# Altium schematic sheet TITLE.SchDoc
size A3; DocumentNumber: 1; Revision: B; SheetNumber: 1; SheetTotal: 7; SheetTitle: Block Diagrams; Designer: DM; Reviewer: -
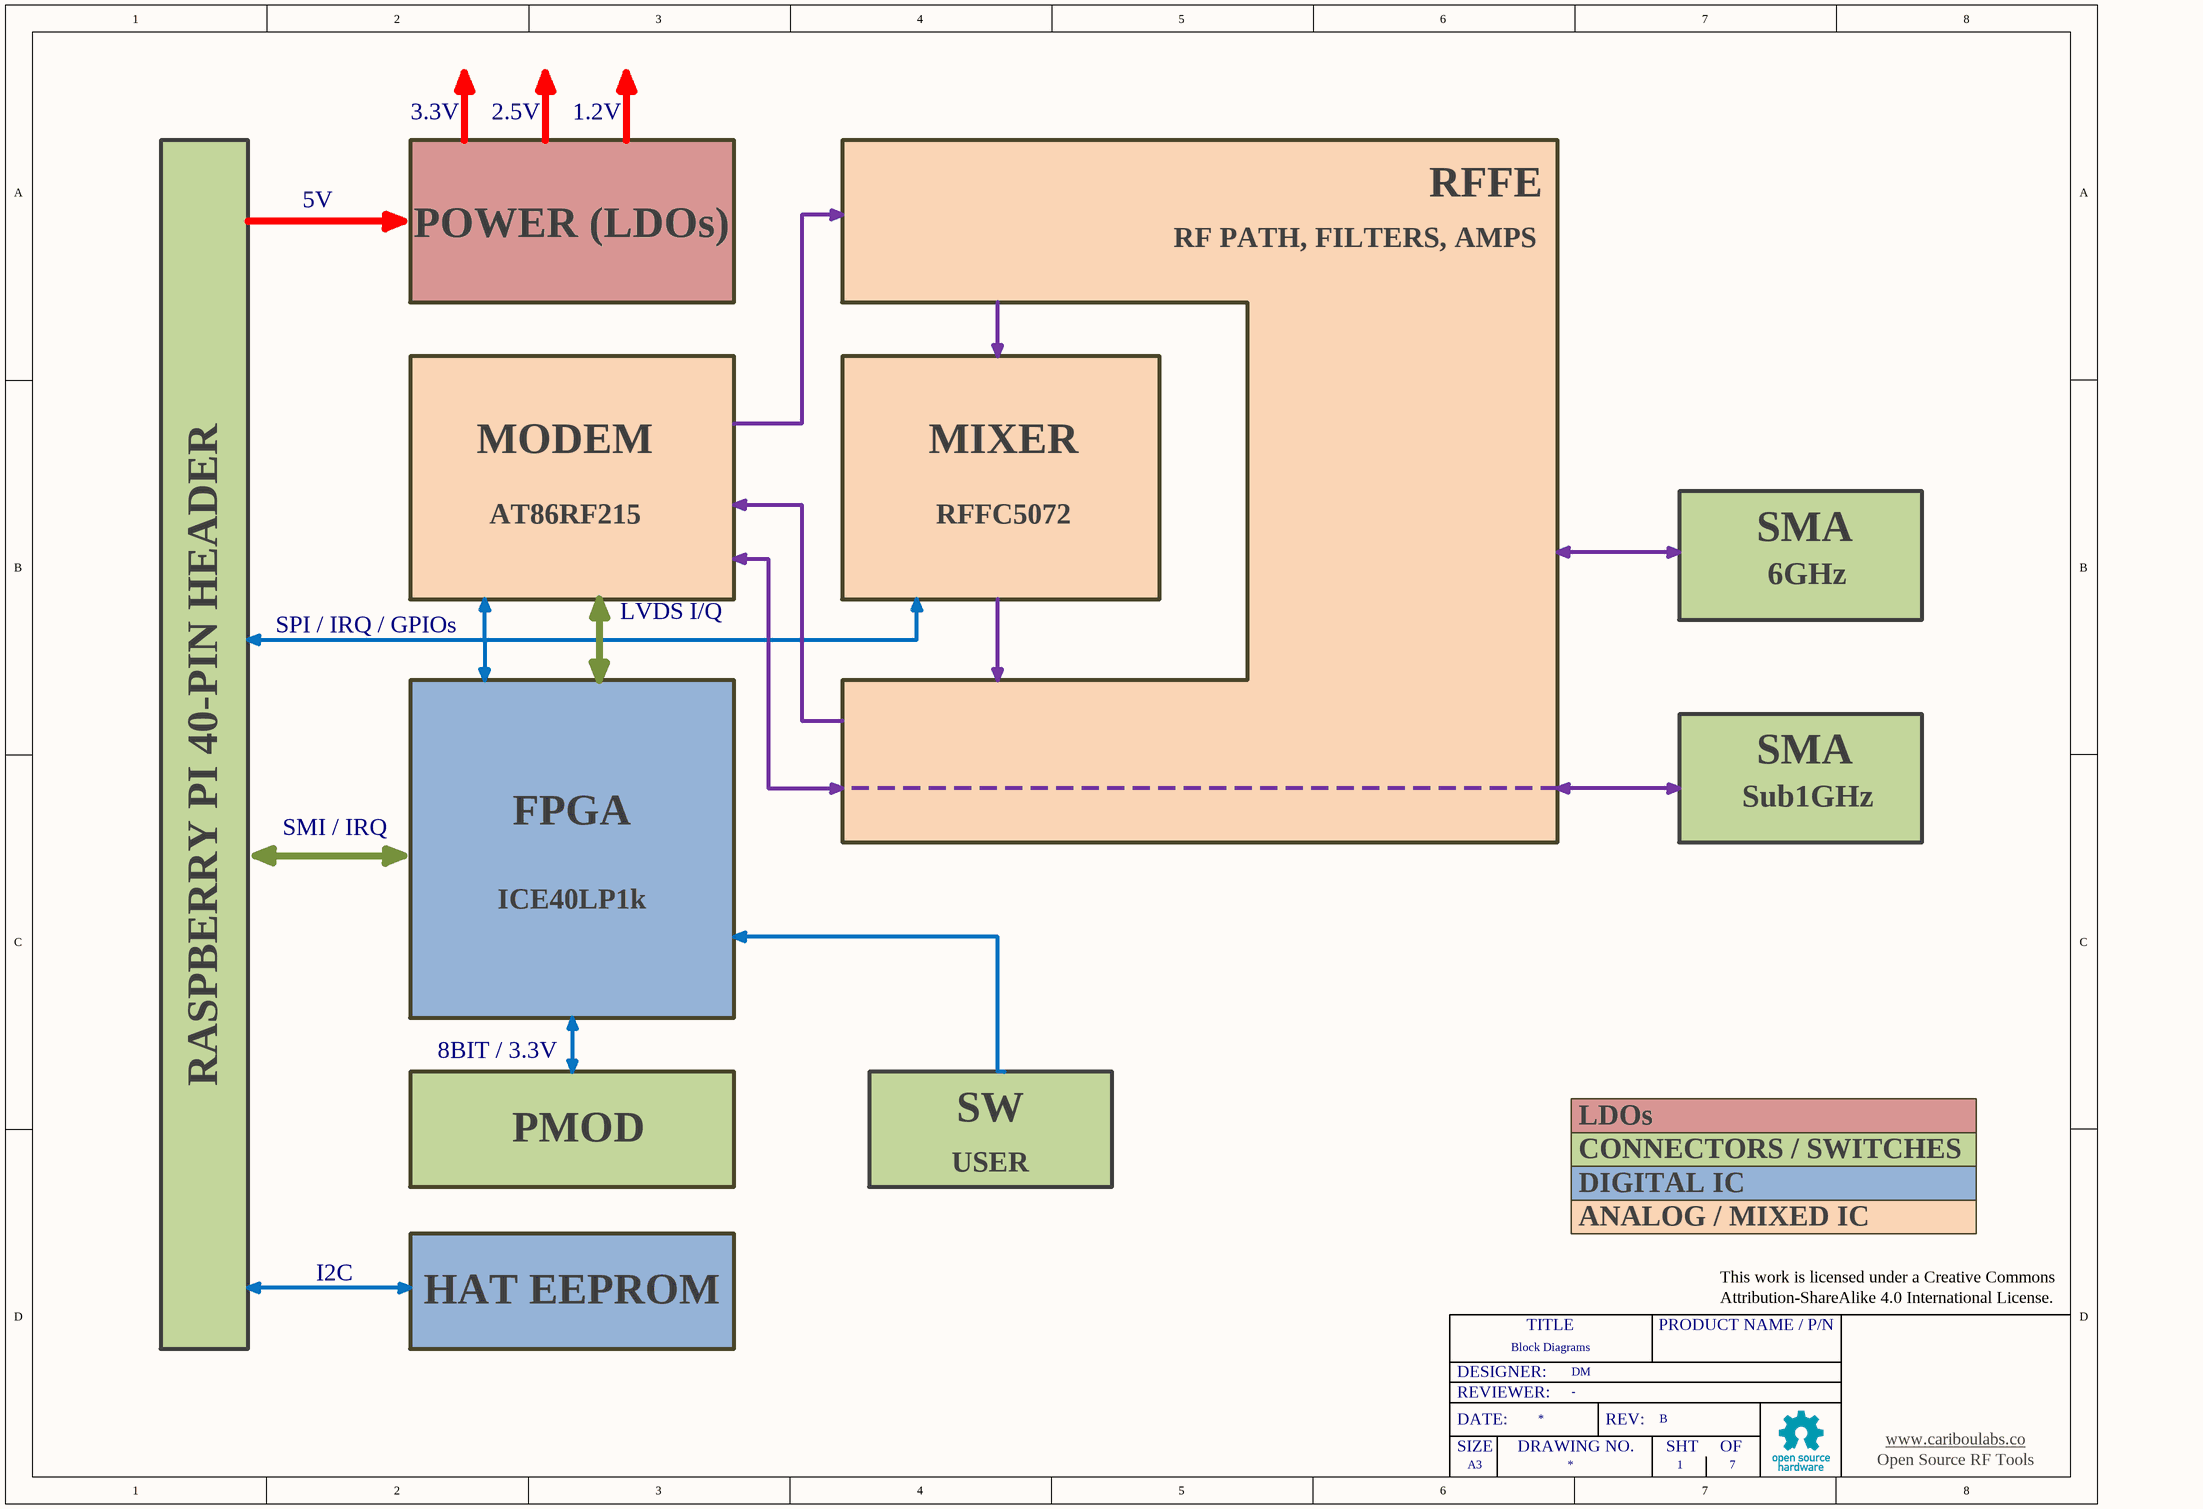
[diagram p0: TITLE.SchDoc]

## Notes on the sheet
- 3.3V
- 2.5V
- 1.2V
- 5V
- POWER (LDOs)
- RFFE
- RF PATH, FILTERS, AMPS
- MODEM
- MIXER
- AT86RF215
- RFFC5072
- 6GHz
- SMA
- SPI / IRQ / GPIOs
- LVDS I/Q
- RASPBERRY PI 40-PIN HEADER
- SMI / IRQ
- FPGA
- Sub1GHz
- ICE40LP1k
- 8BIT / 3.3V
- SW
- LDOs
- PMOD
- USER
- CONNECTORS / SWITCHES
- DIGITAL IC
- ANALOG / MIXED IC
- I2C
- HAT EEPROM
- This work is licensed under a Creative Commons
- Attribution-ShareAlike 4.0 International License.
- DESIGNER:
- REVIEWER:
- TITLE
- PRODUCT NAME / P/N
- SIZE
- DATE:
- DRAWING NO.
- REV:
- SHT
- OF
- www.cariboulabs.co
- A3
- Open Source RF Tools